# EAGLE design arduino hc (EAGLE 9.6.2)
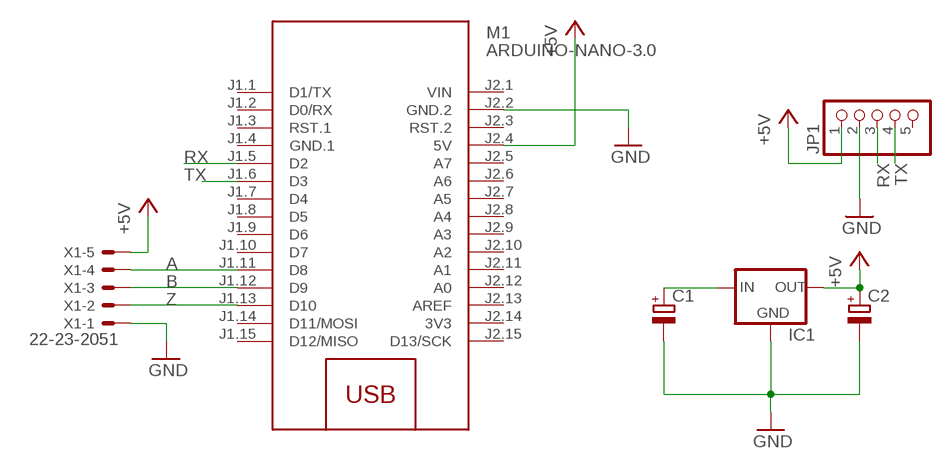
[diagram p0: schematic, sheet 1]

## Parts
C1  CPOL-EUE2,5-6E  [E2,5-6E]
C2  CPOL-EUE2,5-6E  [E2,5-6E]
IC1  78XXS  [78XXS]
JP1  PINHD-1X5  [1X05]
M1  ARDUINO-NANO-3.0  [ARDUINO-NANO-3.0]
X1  22-23-2051  [22-23-2051]

## Nets
+5V: C2.+ IC1.OUT JP1.1 M1.J2.4(5V) X1.5
A: M1.J1.11(D8) X1.4
B: M1.J1.12(D9) X1.3
GND: C1.- C2.- IC1.GND JP1.2 M1.J2.2(GND.2) X1.1
RX: JP1.3 M1.J1.5(D2)
TX: JP1.4 M1.J1.6(D3)
VCC: C1.+ IC1.IN
Z: M1.J1.13(D10) X1.2
Unconnected: JP1.5 M1.J1.1(D1/TX) M1.J1.2(D0/RX) M1.J1.3(RST.1) M1.J1.7(D4) M1.J1.8(D5) M1.J1.9(D6) M1.J1.10(D7) M1.J1.14(D11/MOSI) M1.J1.15(D12/MISO) M1.J2.3(RST.2) M1.J2.5(A7) M1.J2.6(A6) M1.J2.7(A5) M1.J2.8(A4) M1.J2.9(A3) M1.J2.10(A2) M1.J2.11(A1) M1.J2.12(A0) M1.J2.13(AREF) M1.J2.15(D13/SCK)

## Power pins joined to a net without a drawn wire
3V3: M1.J2.14(3V3)
GND.1: M1.J1.4(GND.1)
VIN: M1.J2.1(VIN)

## Library data of the parts
C1 C2 = rcl:CPOL-EU: POLARIZED CAPACITOR, European symbol; SPICEPREFIX: C
IC1 = v-reg:78XXS: VOLTAGE REGULATOR
JP1 = pinhead:PINHD-1X5: PIN HEADER
M1 = diy-modules:ARDUINO-NANO-3.0: Arduino Nano 3.0 and compatible devices More details available here: https://www.arduino.cc/en/Main/ArduinoBoardNano Click here to find device on ebay.com <http://www.ebay.com/sch/arduino+nano>
X1 = con-molex:22-23-2051: .100" (2.54mm) Center Header - 5 Pin; MF: MOLEX; MPN: 22-23-2051; OC_FARNELL: 1462952; OC_NEWARK: 38C9178

## Board
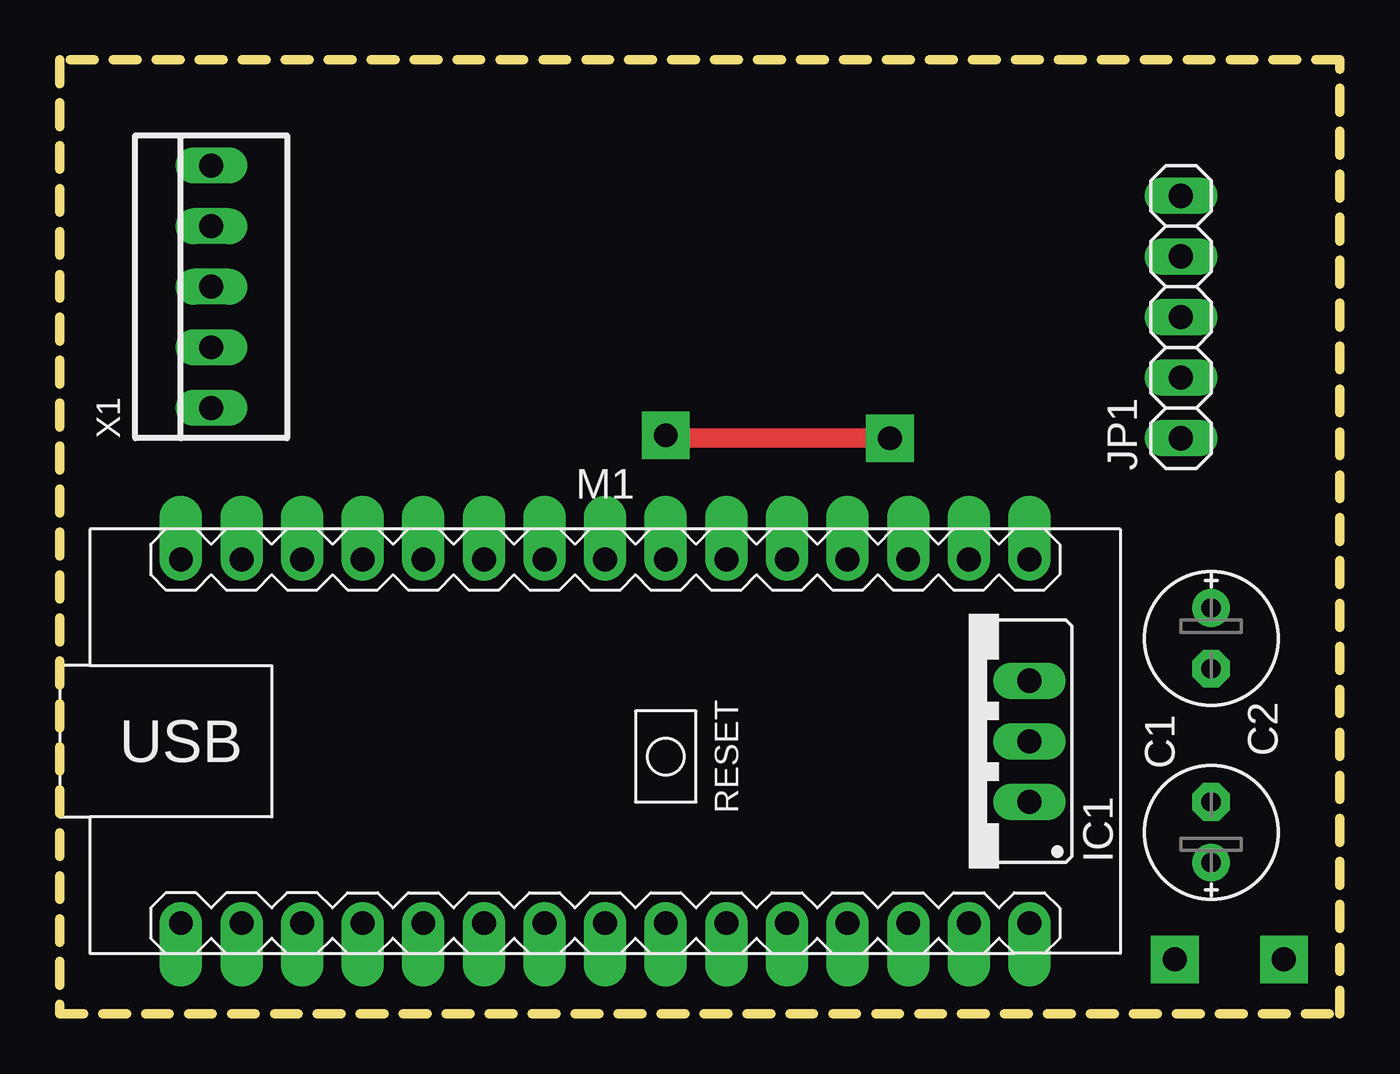
[diagram p1: board, top side]
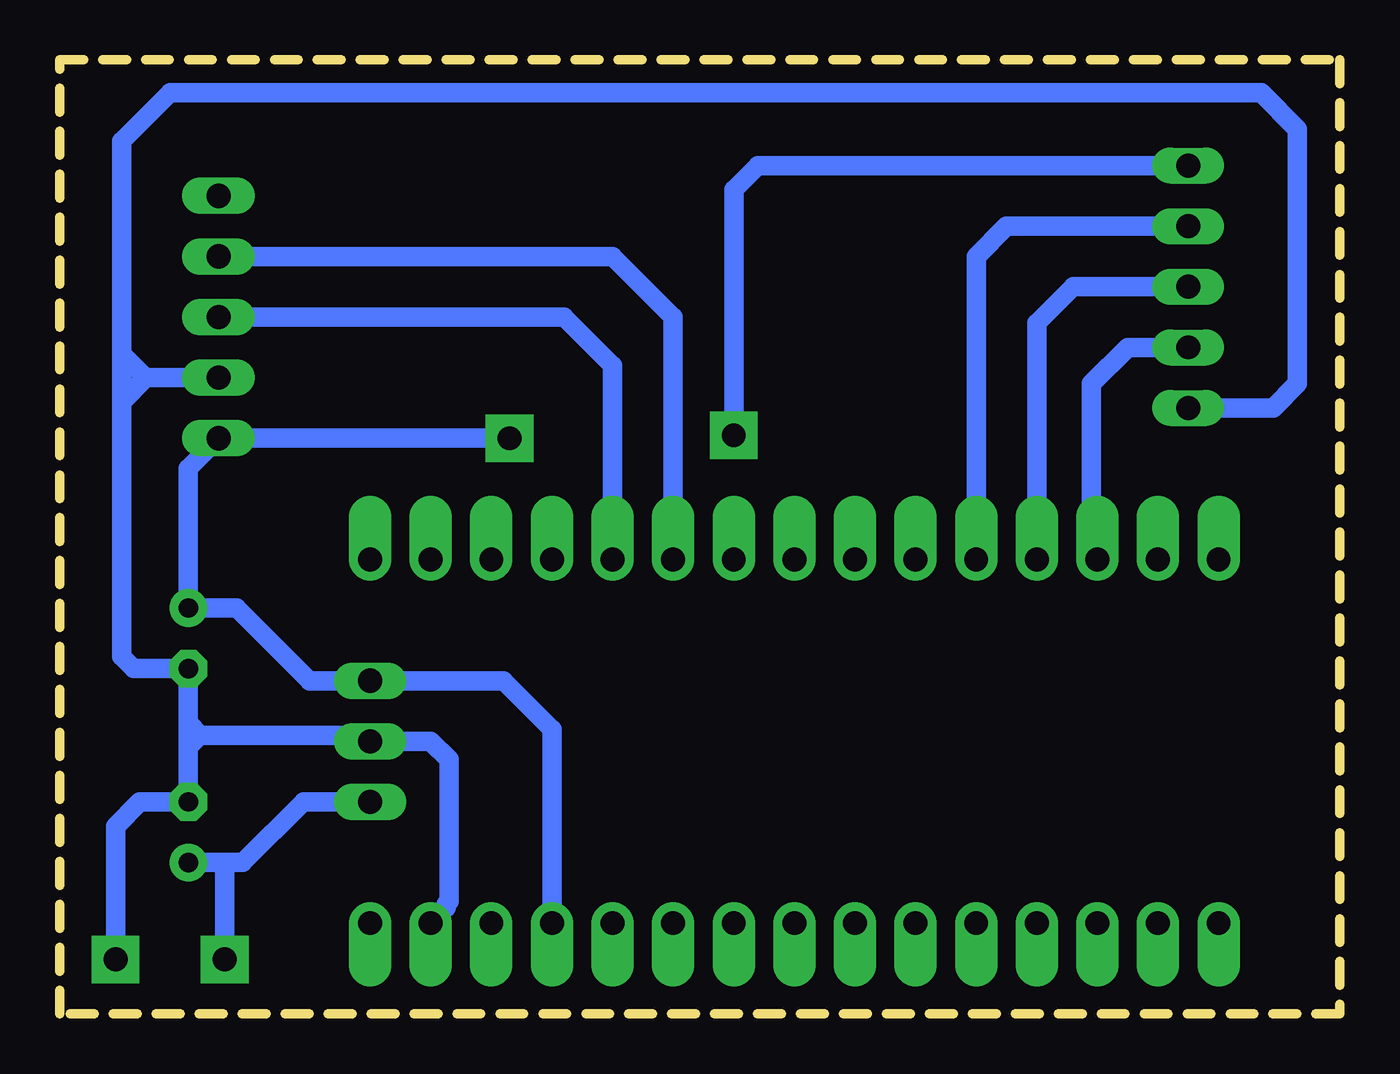
[diagram p2: board, bottom side, seen from below]

Size 53.65 x 40 mm. Coordinates in mm from the lower left corner, seen from the top.
Outline: 0,0 53.65,0 53.65,40 0,40 0,0
Copper layers (1*16): Top 0.035mm / dielectric 1.5mm / Bottom 0.035mm
Design rules "default": minimum track width 6mil, minimum drill 0.35mm, track to track 24mil, track to pad 24mil, pad to pad 24mil, via to via 24mil, smd to smd 24mil, copper to edge 40mil, drill to drill 6mil, minimum pad ring 10mil, minimum via ring 8mil, stop-mask expansion 4mil, vias tented up to drill 0mil, thermal gap 10mil

### Footprints (pad centres in the part's own frame; a part is rotated, then mirrored left to right if it is on the bottom)
E2,5-6E = drill 0.813 pad 1.575: + -1.27,0 | drill 0.813 pad 1.575 octagon: - 1.27,0
78XXS = drill 1.016 long: GND 0,-2.54; IN -2.54,-2.54; OUT 2.54,-2.54
1X05 = drill 1.016 long: 1 -5.08,0; 2 -2.54,0; 3 0,0; 4 2.54,0; 5 5.08,0
ARDUINO-NANO-3.0 = drill 1 pad 1.778 offset: J1.1 17.78,7.62; J1.2 15.24,7.62; J1.3 12.7,7.62; J1.4 10.16,7.62; J1.5 7.62,7.62; J1.6 5.08,7.62; J1.7 2.54,7.62; J1.8 0,7.62; J1.9 -2.54,7.62; J1.10 -5.08,7.62; J1.11 -7.62,7.62; J1.12 -10.16,7.62; J1.13 -12.7,7.62; J1.14 -15.24,7.62; J1.15 -17.78,7.62; J2.1 17.78,-7.62; J2.2 15.24,-7.62; J2.3 12.7,-7.62; J2.4 10.16,-7.62; J2.5 7.62,-7.62; J2.6 5.08,-7.62; J2.7 2.54,-7.62; J2.8 0,-7.62; J2.9 -2.54,-7.62; J2.10 -5.08,-7.62; J2.11 -7.62,-7.62; J2.12 -10.16,-7.62; J2.13 -12.7,-7.62; J2.14 -15.24,-7.62; J2.15 -17.78,-7.62
22-23-2051 = drill 1 long: 1 -5.08,0; 2 -2.54,0; 3 0,0; 4 2.54,0; 5 5.08,0

### Placement (x,y rotation side)
C1  48.26,7.62 90 top
C2  48.26,15.75 270 top
IC1  38.1,11.43 90 top
JP1  46.99,29.21 90 top
M1  22.86,11.43 0 top
X1  6.35,30.48 90 top

### Tracks (layer width: path | path; a pad name or v marks a point on that pad's centre or on a via)
+5V  (via drill 1 pad 2)
  Top 0.813: v34.8,24.13 25.53,24.13 v25.4,24.26
  Bottom 0.813: M1.J2.4 33.02,11.94 35.05,13.97 IC1.OUT 43.18,13.97 46.23,17.02 C2.+ 48.26,22.86 JP1.1 v34.8,24.13 | X1.5 24.38,35.56 25.4,34.54 v25.4,24.26
A
  Bottom 0.813: X1.4 13.97,33.02 15.24,31.75 M1.J1.11
B
  Bottom 0.813: X1.3 11.18,30.48 12.7,28.96 M1.J1.12
GND  (via drill 1 pad 2)
  Bottom 0.813: 48.26,12.19 C2.- 50.55,14.48 51.05,14.99 51.05,25.65 | 48.26,12.19 48.26,11.68 | 48.26,11.68 48.26,11.18 | 48.26,11.18 C1.- 50.29,8.89 51.31,7.87 v51.31,2.29 | 47.75,11.68 40.89,11.68 IC1.GND 38.1,11.43 37.34,10.67 37.34,4.73 37.47,4.6 37.47,4.45 M1.J2.2 | 48.26,11.68 47.75,11.68 | 47.75,11.68 48.26,12.19 | 47.75,11.68 48.26,11.18 | 51.05,25.65 50.04,26.67 | 50.04,26.67 JP1.2 | X1.1 2.79,25.4 1.78,26.42 1.78,37.08 3.3,38.61 49.02,38.61 51.05,36.58 51.05,27.69 | 51.05,27.69 51.05,25.65 | 50.04,26.67 51.05,27.69
RX
  Bottom 0.813: M1.J1.5 30.48,27.18 32.51,29.21 JP1.3
TX
  Bottom 0.813: M1.J1.6 27.94,29.21 30.48,31.75 JP1.4
VCC  (via drill 1 pad 2)
  Bottom 0.813: IC1.IN 43.43,8.89 45.97,6.35 46.48,6.35 | 46.48,6.35 C1.+ | v46.74,2.29 46.74,6.1 46.48,6.35
Z
  Bottom 0.813: X1.2 8.89,27.94 10.41,26.42 10.41,19.3 M1.J1.13